# Altium schematic sheet 路径自动切换电路-第二类-小功率.SchDoc
size A4; SheetNumber: 7; SheetTotal: 7
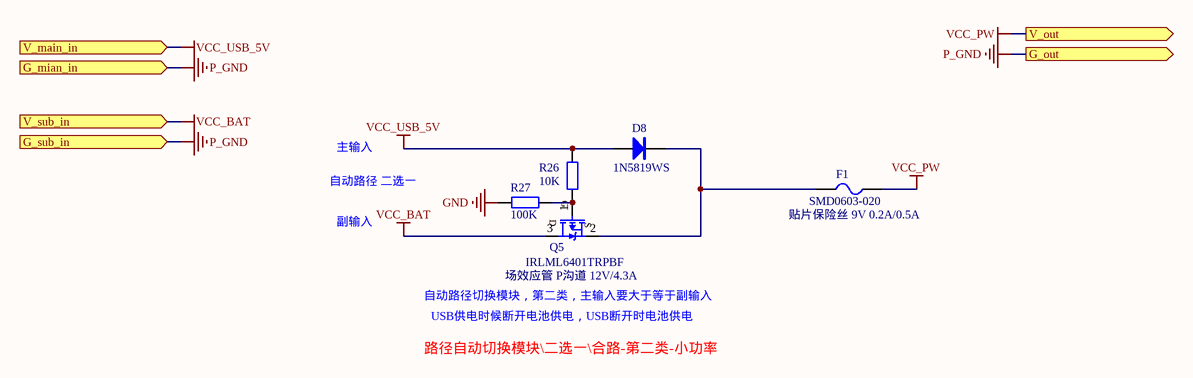
[diagram p0: 路径自动切换电路-第二类-小功率.SchDoc]

## Parts
D8  1N5819WS  [SOD-323]
F1  SMD0603-020  [FU 0603]
Q5  IRLML6401TRPBF  [SOT23-3N]
R26  10K  [R 0402_L]
R27  100K  [R 0402_L]

## Ports
G_mian_in (in), G_out (out), G_sub_in (in), V_main_in (in), V_out (out), V_sub_in (in)

## Nets
GND: R27.1
P_GND: port G_mian_in, port G_out, port G_sub_in
VCC_BAT: Q5.3(D) ; port V_sub_in
VCC_PW: F1.1 ; port V_out
VCC_USB_5V: D8.1(A) R26.2 ; port V_main_in
NetD8_2: D8.2(K) F1.2 Q5.2(S)
NetQ5_1: Q5.1(G) R26.1 R27.2

## Notes on the sheet
- 主输入
- 自动路径 二选一
- 副输入
- 自动路径切换模块，第二类，主输入要大于等于副输入
- 路径自动切换模块\二选一\合路-第二类-小功率
- USB供电时候断开电池供电，USB断开时电池供电
- Title
- Start date:
- Revision:
- Sheet
- Last date:
- of
- Organization:
- Drawn by:
- Checked by:
- Size:
- A4

## Library data of the parts
D8 = 1N5819: 肖特基二极管; 版权归属: 源创客; 属性: 40V/2A; BOM名称: 肖特基二极管; 学习资源: www.ooocke.com
F1 = FU: 贴片保险丝 9V 0.2A/0.5A; 版权归属: 源创客; BOM名称: 贴片保险丝 9V 0.2A/0.5A; 学习资源: www.ooocke.com
Q5 = P-MOS: 场效应管 P沟道 12V/4.3A; 版权归属: 源创客; 学习资源: www.ooocke.com; BOM名称: 场效应管 P沟道 12V/4.3A
R26 R27 = R: 贴片电阻 E-96 1%; BOM名称: E-96 1%